# EAGLE design ReflowController (EAGLE 7.5.0)
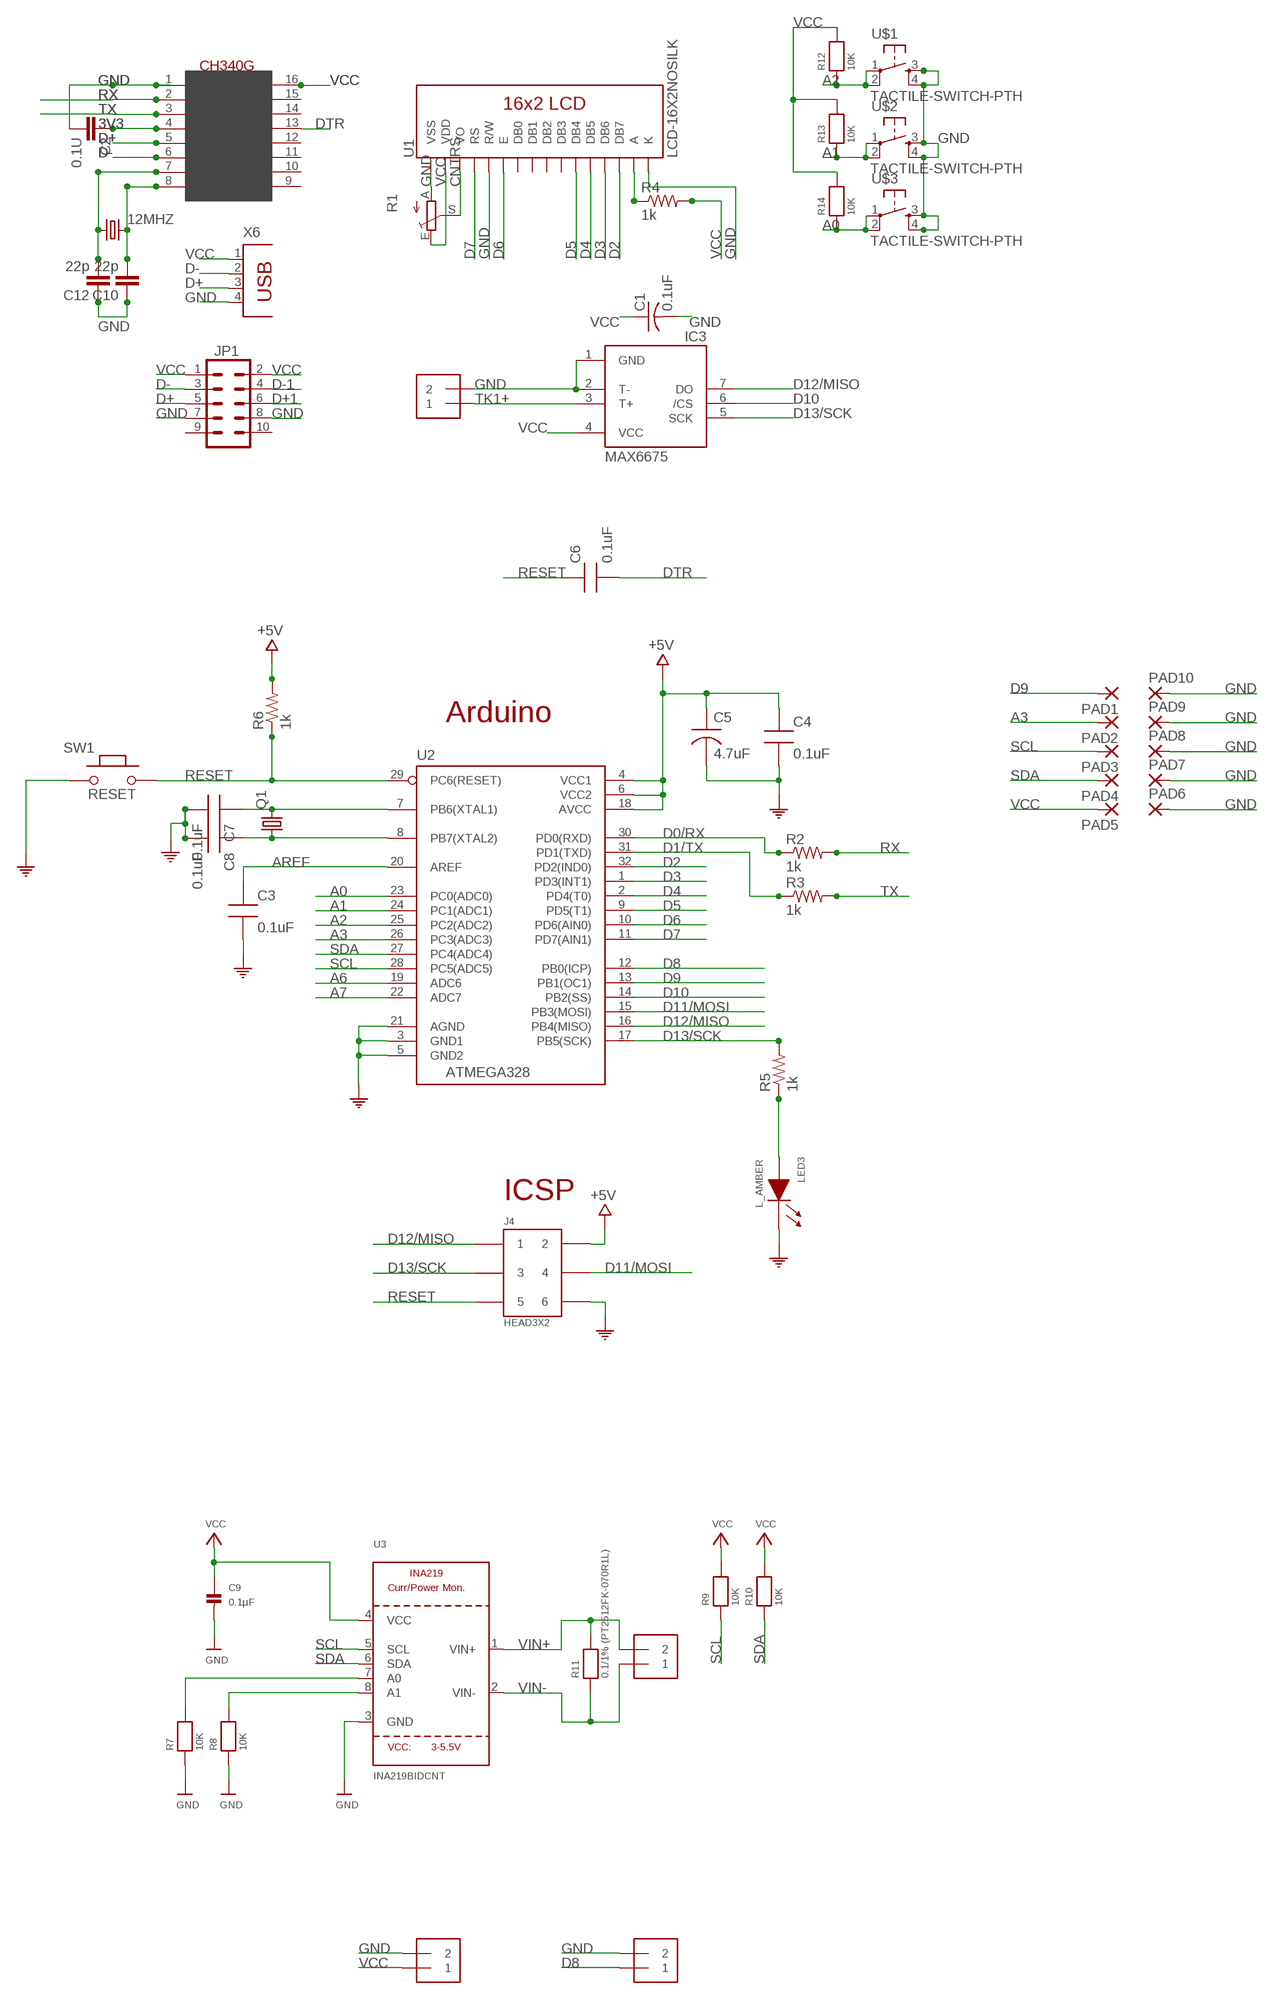
[diagram p0: schematic, sheet 1]

## Parts
12MHZ  CRYSTALHC49UP  [HC49UP]
C1  0.1uF  C-USC0805K  [C0805K]
C2  0.1U  C-EUC1206  [C1206]
C3  0.1uF  CAP0805-NP  [CAP0805-NP]
C4  0.1uF  CAP0805-NP  [CAP0805-NP]
C5  4.7uF  CAP-TANA-P  [TAN-A]
C6  0.1uF  CAP0805-NP  [CAP0805-NP]
C7  0.1uF  CAP0805-NP  [CAP0805-NP]
C8  0.1uF  CAP0805-NP  [CAP0805-NP]
C9  0.1µF  CAP_CERAMIC0805  [0805]
C10  22p  C-EUC1206  [C1206]
C12  22p  C-EUC1206  [C1206]
IC3  MAX6675  [SO08]
J1  TERMBLOCK_1X2-3.5MM  [1X2-3.5MM]
J2  1X2-3.5MM  [1X2-3.5MM]
J3  TERMBLOCK_1X2-3.5MM  [1X2-3.5MM]
J4  HEAD3X2  [HEAD3X2]
J5  TERMBLOCK_1X2-3.5MM  [1X2-3.5MM]
JP1  M05X2SHD_LOCK  [2X5-SHROUDED_LOCK]
LED3  L_AMBER  LED0805  [LED0805]
PAD1  SMD2  [SMD1,27-2,54]
PAD2  SMD2  [SMD1,27-2,54]
PAD3  SMD2  [SMD1,27-2,54]
PAD4  SMD2  [SMD1,27-2,54]
PAD5  SMD2  [SMD1,27-2,54]
PAD6  SMD2  [SMD1,27-2,54]
PAD7  SMD2  [SMD1,27-2,54]
PAD8  SMD2  [SMD1,27-2,54]
PAD9  SMD2  [SMD1,27-2,54]
PAD10  SMD2  [SMD1,27-2,54]
Q1  CRYSTALHC49UP  [HC49UP]
R1  TRIM_EU-CA9V  [CA9V]
R2  1k  RESISTOR1206  [1206]
R3  1k  RESISTOR1206  [1206]
R4  1k  RESISTOR1206  [1206]
R5  1k  RESISTOR1206  [1206]
R6  1k  RESISTOR1206  [1206]
R7  10K  RESISTOR0805  [0805]
R8  10K  RESISTOR0805  [0805]
R9  10K  RESISTOR0805  [0805]
R10  10K  RESISTOR0805  [0805]
R11  0.1/1% (PT2512FK-070R1L)  RESISTOR2512  [2512]
R12  10K  RESISTOR0805  [0805]
R13  10K  RESISTOR0805  [0805]
R14  10K  RESISTOR0805  [0805]
SW1  RESET  PB157  [157SW]
U1  LCD-16X2NOSILK  [LCD-16X2_NOSILK]
U2  ATMEGA328  ATMEGA168-20AU  [QFP032]
U3  INA219BIDCNT  INA219  [SOT23-8]
U$1  TACTILE-SWITCH-PTH  [TAC-SWITCH-PTH]
U$2  TACTILE-SWITCH-PTH  [TAC-SWITCH-PTH]
U$3  TACTILE-SWITCH-PTH  [TAC-SWITCH-PTH]
U$4  CH340G  [SOIC16]
X6  PN61729  [PN61729]

## Nets
3V3: C2.1 U$4.4(V3)
A0: R14.1 U2.23(PC0(ADC0)) U$3.1 U$3.2
A1: R13.1 U2.24(PC1(ADC1)) U$2.1 U$2.2
A2: R12.1 U2.25(PC2(ADC2)) U$1.1 U$1.2
A3: PAD2.1(P) U2.26(PC3(ADC3))
A6: U2.19(ADC6)
A7: U2.22(ADC7)
AREF: C3.1 U2.20(AREF)
CNTRS: R1.S U1.3(VO)
D0/RX: R2.1 U2.30(PD0(RXD))
D1/TX: R3.1 U2.31(PD1(TXD))
D2: U1.14(DB7) U2.32(PD2(IND0))
D3: U1.13(DB6) U2.1(PD3(INT1))
D4: U1.12(DB5) U2.2(PD4(T0))
D5: U1.11(DB4) U2.9(PD5(T1))
D6: U1.6(E) U2.10(PD6(AIN0))
D7: U1.4(RS) U2.11(PD7(AIN1))
D8: J3.1 U2.12(PB0(ICP))
D9: PAD1.1(P) U2.13(PB1(OC1))
D10: IC3.6(/CS) U2.14(PB2(SS))
D11/MOSI: J4.4 U2.15(PB3(MOSI))
D12/MISO: IC3.7(DO) J4.1 U2.16(PB4(MISO))
D13/SCK: IC3.5(SCK) J4.3 R5.2 U2.17(PB5(SCK))
D+: JP1.5 U$4.5(D+) X6.3
D+1: JP1.6
D-: JP1.3 U$4.6(D-) X6.2
D-1: JP1.4
DTR: C6.2 U$4.13(DTR)
GND: C1.2 C2.2 C3.2 C4.2 C5.2 C7.2 C8.2 C9.2 C10.1 C12.1 IC3.1(GND) IC3.2(T-) J2.2 J3.2 J4.6 J5.2 JP1.7 JP1.8 LED3.1(CA) PAD6.1(P) PAD7.1(P) PAD8.1(P) PAD9.1(P) PAD10.1(P) R1.A R7.1 R8.1 SW1.1 U1.1(VSS) U1.5(R/W) U1.16(K) U2.3(GND1) U2.5(GND2) U2.21(AGND) U3.3(GND) U$1.3 U$1.4 U$2.3 U$2.4 U$3.3 U$3.4 U$4.1(GND) X6.4 ; supply symbol labelled COM
N$1: C8.1 Q1.1 U2.8(PB7(XTAL2))
N$2: C7.1 Q1.2 U2.7(PB6(XTAL1))
N$3: R8.2 U3.8(A1)
N$4: R7.2 U3.7(A0)
N$7: LED3.2(AN) R5.1
N$11: R4.1 U1.15(A)
N$12: 12MHZ.1 C12.2 U$4.7(XI)
N$13: 12MHZ.2 C10.2 U$4.8(XO)
RESET: C6.1 J4.5 R6.1 SW1.2 U2.29(PC6(RESET))
RX: R2.2 U$4.2(TX)
SCL: PAD3.1(P) R9.1 U2.28(PC5(ADC5)) U3.5(SCL)
SDA: PAD4.1(P) R10.1 U2.27(PC4(ADC4)) U3.6(SDA)
TK1+: IC3.3(T+) J2.1
TX: R3.2 U$4.3(RX)
VCC: C1.1 C4.1 C5.1 C9.1 IC3.4(VCC) J4.2 J5.1 JP1.1 JP1.2 PAD5.1(P) R1.E R4.2 R6.2 R9.2 R10.2 R12.2 R13.2 R14.2 U1.2(VDD) U2.4(VCC1) U2.6(VCC2) U2.18(AVCC) U3.4(VCC) U$4.16(VCC) X6.1 ; supply symbol labelled +5V
VIN+: J1.2 R11.2 U3.1(VIN+)
VIN-: J1.1 R11.1 U3.2(VIN-)
Unconnected: JP1.9 JP1.10 U1.7(DB0) U1.8(DB1) U1.9(DB2) U1.10(DB3) U$4.9(CTS) U$4.10(DSR) U$4.11(RI) U$4.12(DCD) U$4.14(RTS) U$4.15(RS232)

## Notes on the sheet
- Arduino
- ICSP

## Library data of the parts
12MHZ = crystal:CRYSTAL: CRYSTAL; OC_FARNELL: unknown; OC_NEWARK: unknown
C1 = adafruit:C-US: CAPACITOR, American symbol
C2 C10 C12 = rcl:C-EU: CAPACITOR, European symbol
C3 C4 C6-C8 = MySMD:CAP0805-NP
C5 = MySMD:CAP-TANA-P
C9 = microbuilder:CAP_CERAMIC: Ceramic Capacitors 0402 - 0402 Surface Mount Capacitors 16pF 50V 5% [Digikey: 445-4899-2-ND] 18pF 50V 5% [Digikey: 490-1281-2-ND] 22pF 50V 5% [Digikey: 490-1283-2-ND] 68pF 50V 5% [Digikey: 490-1289-2-ND] 0.1uF 10V 10% [Digikey: 490-1318-2-ND] 1.0uF 6.3V 10% [Digikey: 490-1320-2-ND] 0603 - 0603 Surface Mount Capacitors 16 pF 50V 5% [Digikey: 445-5051-2-ND] 22 pF 50V [Digikey: PCC220ACVTR-ND] 33 pF 50V 5% [Digikey: 490-1415-1-ND] 56pF 50V 5% [Digikey: 490-1421-1-ND] 220pF 50V 5% [Digikey: 445-1285-1-ND] 680 pF 50V 2200 pF 50V 5% C0G [Digikey: 445-1297-1-ND] 5600 pF 100V 5% X7R [Digikey: 478-3711-1-ND] 0.1 µF 25V 10% [Digikey: PCC2277TR-ND] 0.22 µF 16V 10% X7R [Digikey: 445-1318-1-ND] 1.0 µF 25V 10% [Digikey: 445-5146-2-ND] 0603 - RF Specific 3pF 250V +/-0.1pF RF [Digikey: 712-1347-1-ND] 18 pF 250V 5% [Digikey: 478-3505-1-ND or 712-1322-1-ND] 56 pF 250V 5% C0G RF [Digikey: 490-4867-1-ND] 68 pF 250V RF [Digikey: 490-4868-1-ND] 0805 - 0805 Surface Mount Capacitors 220 pF 250V 2% RF Ceramic Capacitor [Digikey: 712-1398-1-ND] 1000 pF 50V 2% NP0 Ceramic Capacitor [Digikey: 478-3760-1-ND] 0.1 µF 25V 10% Ceramic Capacitor [Digikey: PCC1828TR-ND] 1.0 µF 16V 10% Ceramic Capacitor[Digikey: 490-1691-2-ND] 10.0 µF 10V 10% Ceramic Capacitor[Digikey: 709-1228-1-ND] 10.0 uF 16V 10% Ceramic Capacitor [Digikey: 478-5165-2-ND] 47 uF 6.3V 20% Ceramic Capacitor [Digikey: 587-1779-1-ND or 399-5506-1-ND] 1206 - 1206 Surface Mount Capacitors 47uF 10V 20% Ceramic Capacitor [Digikey: 490-5528-1-ND or 399-5508-1-ND or 445-6010-1-ND] 100uF 6.3V -20%, +80% Y5V Ceramic Capacitor (Digikey: 490-4512-1-ND, Mouser: 81-GRM31CF50J107ZE1L)
IC3 = adafruit:MAX6675
J1 J3 J5 = microbuilder:TERMBLOCK_1X2: 3.5mm Terminal block http://www.ladyada.net/library/pcb/eaglelibrary.html
J2 = adafruit:1X2: 3.5mm Terminal block http://www.ladyada.net/library/pcb/eaglelibrary.html
J4 = MyCON2:HEAD3X2
JP1 = SparkFun-Connectors:M05X2: Header 5x2 Standard 10-pin dual row 0.1" header. Commonly used with AVR-ISP. Use with Spark Fun Electronics SKU: PRT-00778
LED3 = MySMD:LED0805
PAD1-PAD10 = wirepad:SMD2: SMD PAD
Q1 = adafruit:CRYSTAL: CRYSTAL; OC_FARNELL: unknown; OC_NEWARK: unknown
R1 = pot:TRIM_EU-: POTENTIOMETER
R2-R6 = SparkFun-Passives:RESISTOR: Resistor Basic schematic elements and footprints for 0603, 1206, and PTH resistors.
R7-R14 = microbuilder:RESISTOR: Resistors 0402 - 0402 Surface Mount Package 22 Ohm 1% 1/16W [Digikey: 311-22.0LRTR-ND] 33 Ohm 5% 1/16W 1.0K 5% 1/16W 1.5K 5% 1/16W 2.0K 1% 1/16W 10.0K 1% 1/16W [Digikey: 311-10.0KLRTR-ND] 10.0K 5% 1/16W [Digikey: RMCF0402JT10K0TR-ND] 12.1K 1% 1/16W [Digikey: 311-22.0LRTR-ND] 100.0K 5% 1/16W 0603 - 0603 Surface Mount Package 0 Ohm 1/10 Watt 1% Resistor 15 Ohm 1/10 Watt 1% Resistor 33 Ohm 1/10 Watt 1% Resistor 49.9 Ohm 1/10 Watt 1% Resistor 100 Ohm 1/10 Watt 1% Resistor 150 Ohm 1/10 Watt 1% Resistor 240 Ohm 1/10 Watt 1% Resistor 390 Ohm 1/10 Watt 1% Resistor 560 Ohm 1/10 Watt 1% Resistor 680 Ohm 1/10 Watt 1% Resistor 750 Ohm 1/10 Watt 1% Resistor 1.0K Ohm 1/10 Watt 1% Resistor 1.5K Ohm 1/10 Watt 1% Resistor 2.0K Ohm 1/10 Watt 1% Resistor 2.2K Ohm 1/10 Watt 1% Resistor 3.3K Ohm 1/10 Watt 1% Resistor 4.7K Ohm 1/10 Watt 1% Resistor 10.0K Ohm 1/10 Watt 1% Resistor 12.0K Ohm 1/10 Watt 1% Resistor 12.1K Ohm 1/10 Watt 1% Resistor 20.0K Ohm 1/10 Watt 1% Resistor 33.0K Ohm 1/10 Watt 1% Resistor 100.0K Ohm 1/10 Watt 1% Resistor 0805 - 0805 Surface Mount Package 0 Ohm 1/8 Watt 1% Resistor 33 Ohm 1/8 Watt 1% Resistor 100 Ohm 1/8 Watt 1% Resistor 150 Ohm 1/8 Watt 1% Resistor 200 Ohm 1/8 Watt 1% Resistor 240 Ohm 1/8 Watt 1% Resistor 330 Ohm 1/8 Watt 1% Resistor 390 Ohm 1/8 Watt 1% Resistor 470 Ohm 1/8 Watt 1% Resistor 1.0K Ohm 1/8 Watt 1% Resistor 1.5K Ohm 1/8 Watt 1% Resistor 2.0K Ohm 1/8 Watt 1% Resistor 4.7K Ohm 1/8 Watt 1% Resistor 5.1K Ohm 1/8 Watt 1% Resistor 5.6K Ohm 1/8 Watt 1% Resistor 10.0K Ohm 1/8 Watt 1% Resistor 22.0K Ohm 1/8 Watt 1% Resistor 33.0K Ohm 1/8 Watt 1% Resistor 100K Ohm 1/8 Watt 1% Resistor 1206 - 1206 Surface Mount Package 2012 - 2010 Surface Mount Package 0.11 Ohm 1/2 Watt 1% Resistor - Digikey: RHM.11UCT-ND
SW1 = MySMD:PB157
U1 = SparkFun-Displays:LCD-16X2: Standard text-only 16x2 parallel input LCD
U2 = MySMD:ATMEGA168-20AU
U3 = microbuilder:INA219: INA219 - I2C Current/Power Monitor Voltage Range: 0-26V Accuracy: 0.5% Temperature: -40°C - 125°C
U$1-U$3 = GeekAmmo:TACTILE-SWITCH: Tactile Switch 4 Pins, SPST NO
U$4 = usb-serial:CH340G
X6 = con-berg:PN61729: BERG USB connector; OC_FARNELL: unknown; OC_NEWARK: unknown

## Board
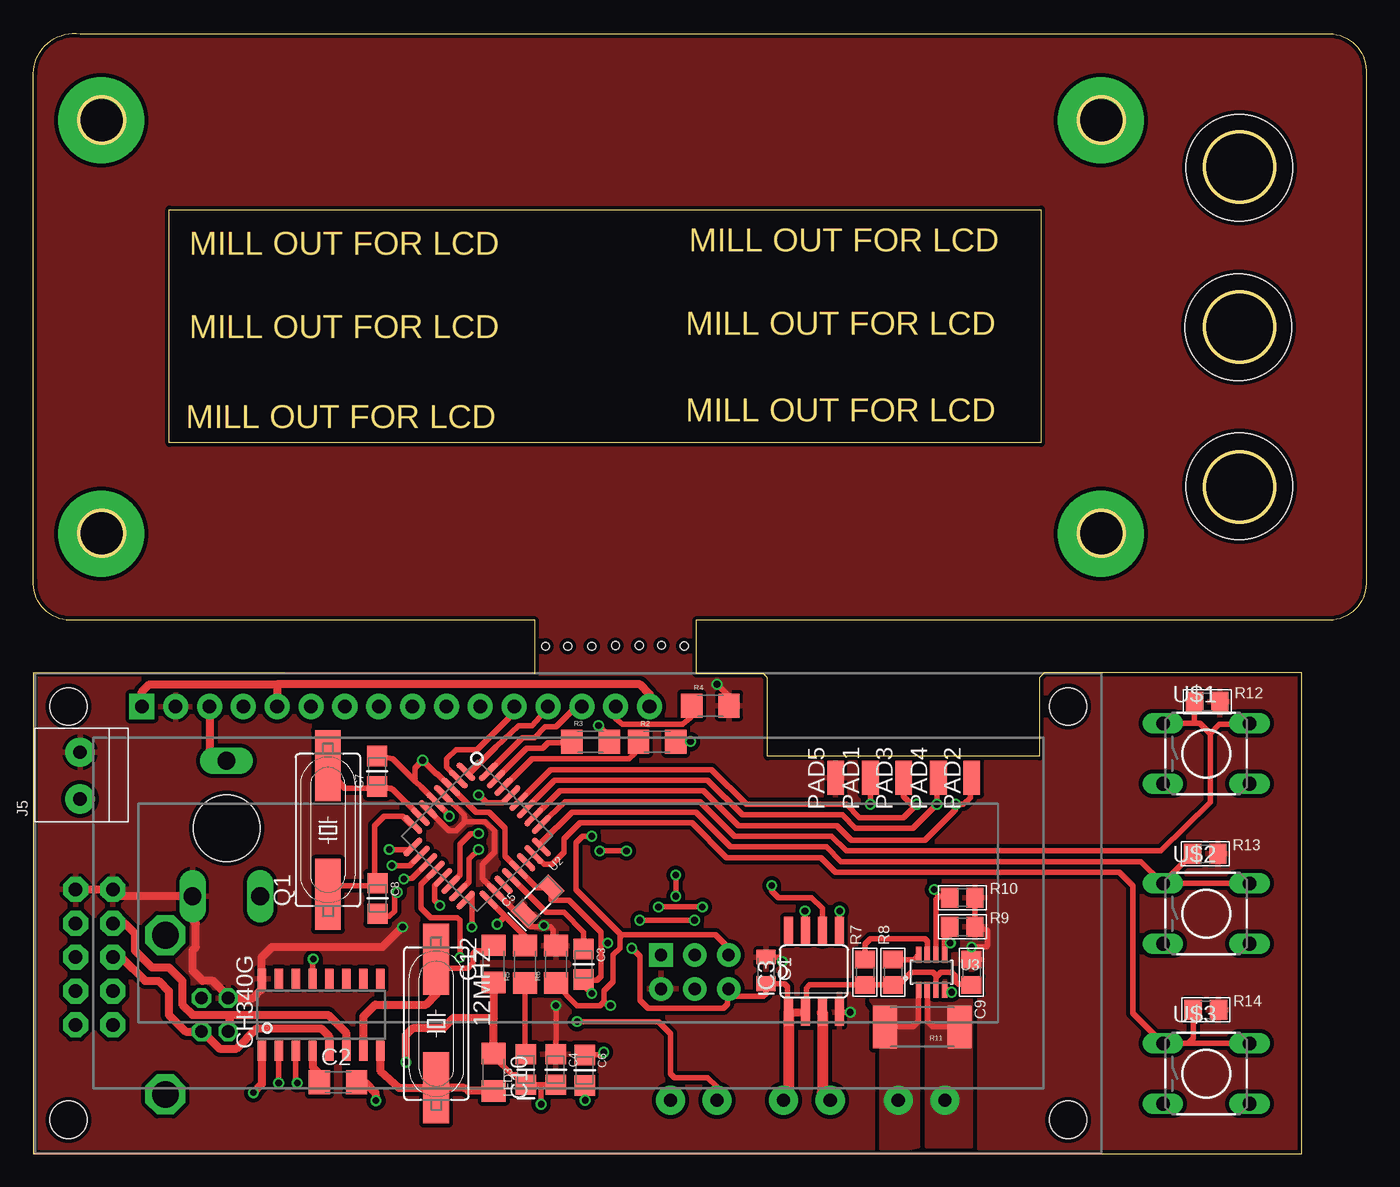
[diagram p1: board, top side]
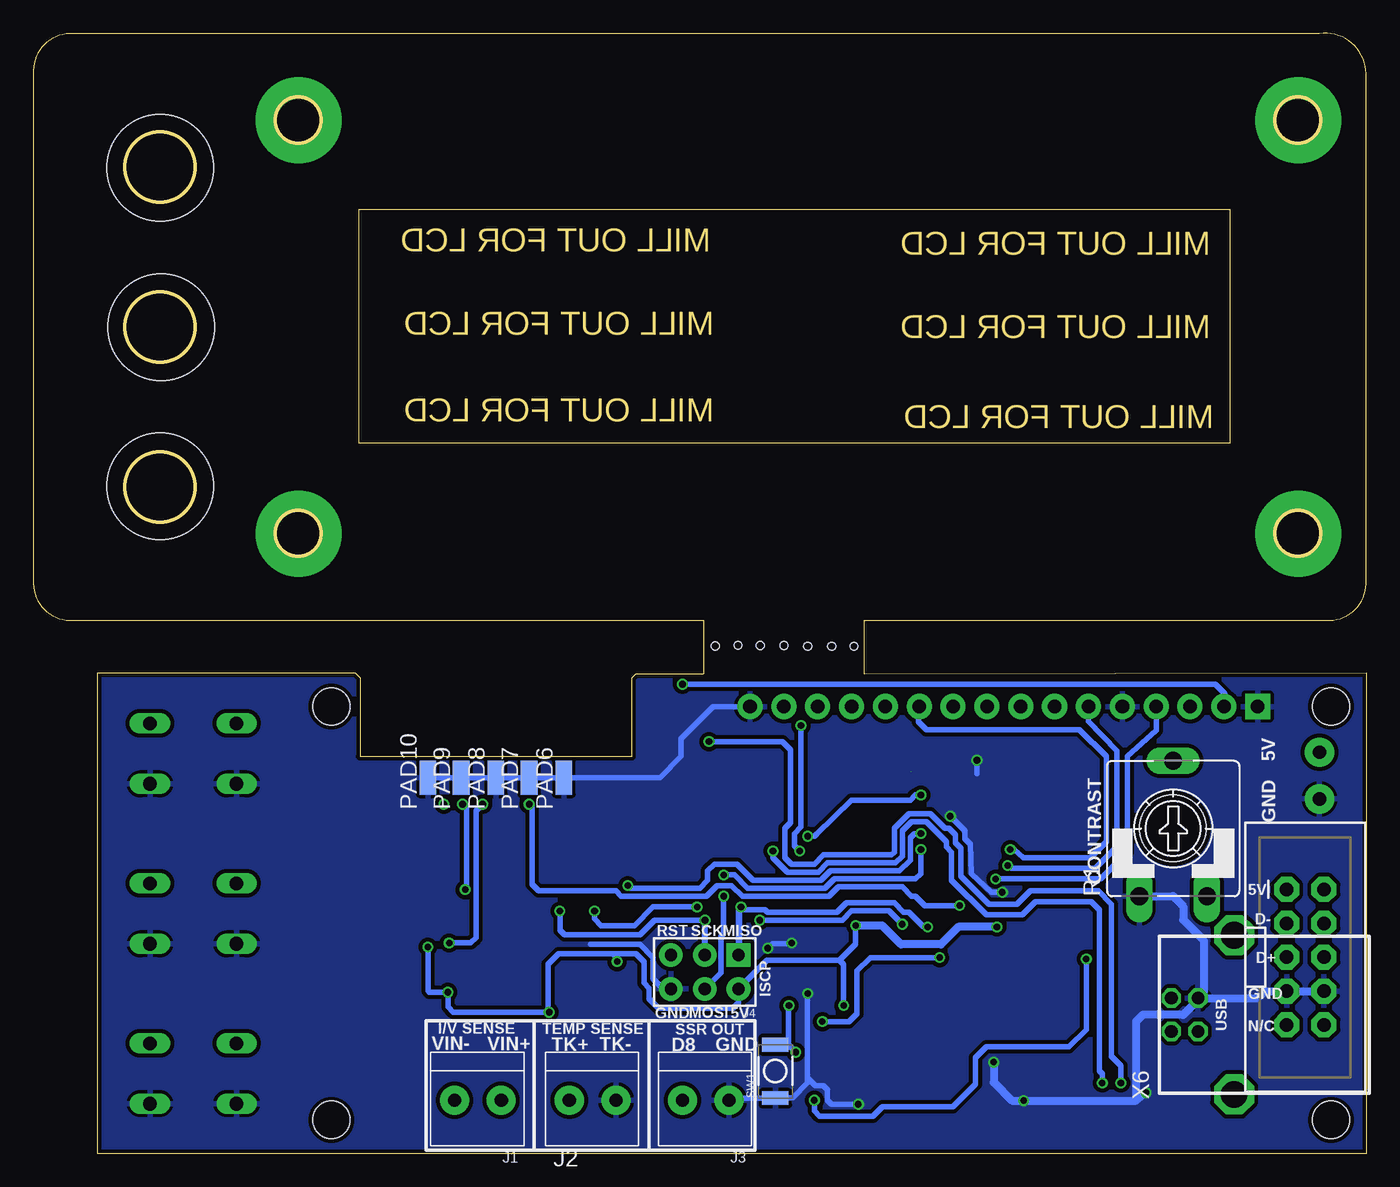
[diagram p2: board, bottom side, seen from below]

Size 100.01 x 84.03 mm. Coordinates in mm from the lower left corner, seen from the top.
Outline: 0,0 95.18,0 95.18,36.06 75.86,36.06 75.5,35.7 75.5,29.8 55.1,29.8 55.1,35.7 54.8,36 49.73,36 49.73,40 97,40 arc97 100,43 100,81 arc97 97,84 3.5,84 arc97 0,81 0,43 arc97 3,40 37.63,40 37.63,36 0,36.06 0,0
Outline: 10.2,70.8 75.6,70.8 75.6,53.3 10.2,53.3 10.2,70.8
Outline: circle at 90.5,74 radius 2.62
Outline: circle at 90.5,62 radius 2.62
Outline: circle at 90.5,50 radius 2.62
Outline: circle at 5.13,77.53 radius 1.71
Outline: circle at 80.15,77.53 radius 1.71
Outline: circle at 5.13,46.52 radius 1.71
Outline: circle at 80.13,46.52 radius 1.71
Copper layers (1*16): Top 0.035mm / dielectric 1.5mm / Bottom 0.035mm
Design rules "dirt_cheap_dirty_boards.v1": minimum track width 5mil, minimum drill 12mil, track to track 5mil, track to pad 5mil, pad to pad 5mil, via to via 5mil, smd to smd 0mil, copper to edge 10mil, drill to drill 10mil, minimum pad ring 10mil, minimum via ring 6mil, stop-mask expansion 2mil, vias tented up to drill 25mil, thermal gap 10mil
Holes 5 mm at 14.5,24.4
Holes 8 mm at 90.5,50.05 90.43,61.98 90.5,73.95
Holes 0.6 mm at 38.43,38.05 40.1,38.05 41.9,38.05 43.68,38.1 45.45,38.1 47.13,38.12 48.83,38.08

### Footprints (pad centres in the part's own frame; a part is rotated, then mirrored left to right if it is on the bottom)
HC49UP = smd 5.334 x 1.93: 1 -4.826,0; 2 4.826,0
C0805K = smd 1.1 x 1.4: 1 -1,0; 2 1,0
C1206 = smd 1.6 x 1.8: 1 -1.4,0; 2 1.4,0
CAP0805-NP = smd 1.524 x 1.524: 1 0,0; 2 2.286,0
TAN-A = smd 1.118 x 1.778: 1 0,0; 2 2.794,0
0805 = smd 1.3 x 1.5: 1 -0.95,0; 2 0.95,0
SO08 = smd 0.66 x 2.032: 1 -1.905,-3.073; 2 -0.635,-3.073; 3 0.635,-3.073; 4 1.905,-3.073; 5 1.905,3.073; 6 0.635,3.073; 7 -0.635,3.073; 8 -1.905,3.073
1X2-3.5MM = drill 1 pad 2.184: 1 1.8,0; 2 -1.7,0
HEAD3X2 = drill 0.914 pad 1.778 square: 1 0,0 | drill 0.914 pad 1.778: 2 0,2.54; 3 2.54,0; 4 2.54,2.54; 5 5.08,0; 6 5.08,2.54
2X5-SHROUDED_LOCK = drill 1.016 pad 1.88 octagon: 1 -1.397,5.08; 2 1.397,5.08; 3 -1.397,2.54; 4 1.397,2.54; 5 -1.397,0; 6 1.397,0; 7 -1.397,-2.54; 8 1.397,-2.54; 9 -1.397,-5.08; 10 1.397,-5.08
LED0805 = smd 1.524 x 1.524: 1 0,0; 2 2.286,0
SMD1,27-2,54 = smd 1.27 x 2.54: 1 0,0
CA9V = drill 1.321 long: A -2.54,-5.08; E 2.54,-5.08; S 0,5.08
1206 = smd 1.6 x 1.8: 1 -1.4,0; 2 1.4,0
2512 = smd 1.8 x 3.2: 1 -2.8,0; 2 2.8,0
157SW = smd 1.016 x 1.981: 1 0,0; 2 4,0
LCD-16X2_NOSILK = drill 1.016 pad 1.88 square: 1 -32,15.5 | drill 1.016 pad 1.88: 2 -29.46,15.5; 3 -26.92,15.5; 4 -24.38,15.5; 5 -21.84,15.5; 6 -19.3,15.5; 7 -16.76,15.5; 8 -14.22,15.5; 9 -11.68,15.5; 10 -9.14,15.5; 11 -6.6,15.5; 12 -4.06,15.5; 13 -1.52,15.5; 14 1.02,15.5; 15 3.56,15.5; 16 6.1,15.5 | hole 2.8: -37.5,15.5; -37.5,-15.5; 37.5,15.5; 37.5,-15.5
QFP032 = smd 0.432 x 1.778: 1 0,0; 2 0.8,0; 3 1.599,0; 4 2.399,0; 5 3.199,0; 6 3.998,0; 7 4.798,0; 8 5.598,0; 17 5.588,8.001; 18 4.798,7.997; 19 3.998,7.997; 20 3.199,7.997; 21 2.399,7.997; 22 1.599,7.997; 23 0.799,7.997; 24 0,7.997 | smd 1.778 x 0.432: 9 6.807,1.194; 10 6.807,2.007; 11 6.807,2.794; 12 6.807,3.607; 13 6.807,4.394; 14 6.807,5.182; 15 6.807,5.994; 16 6.816,6.803; 25 -1.194,6.807; 26 -1.194,5.994; 27 -1.194,5.182; 28 -1.194,4.394; 29 -1.194,3.607; 30 -1.194,2.794; 31 -1.194,2.007; 32 -1.194,1.194
SOT23-8 = smd 0.4 x 1.2: 1 -0.975,-1.3; 2 -0.325,-1.3; 3 0.325,-1.3; 4 0.975,-1.3; 5 0.975,1.3; 6 0.325,1.3; 7 -0.325,1.3; 8 -0.975,1.3
TAC-SWITCH-PTH = drill 1.016 pad 1.524 long: 1 -3.251,2.261; 2 3.251,2.261; 3 -3.251,-2.261; 4 3.251,-2.261
SOIC16 = smd 0.635 x 1.524: 1 -4.445,-2.695; 2 -3.175,-2.695; 3 -1.905,-2.695; 4 -0.635,-2.695; 5 0.635,-2.695; 6 1.905,-2.695; 7 3.175,-2.695; 8 4.445,-2.695; 9 4.445,2.695; 10 3.175,2.695; 11 1.905,2.695; 12 0.635,2.695; 13 -0.635,2.695; 14 -1.905,2.695; 15 -3.175,2.695; 16 -4.445,2.695
PN61729 = drill 0.95 octagon: 1 1.25,4.71; 2 -1.25,4.71; 3 -1.25,2.71; 4 1.25,2.71 | drill 2 octagon: P$1 -5.969,0; P$2 5.969,0

### Placement (x,y rotation side)
12MHZ  30.23,9.76 270 top
C1  54.97,13.74 270 top
C2  22.86,5.33 0 top
C3  41.29,15.34 270 top
C4  39.19,7.45 270 top
C5  36.87,17.97 45 top
C6  41.37,7.4 270 top
C7  25.8,27.54 90 top
C8  25.83,20.28 270 top
C9  70.4,13.6 270 top
C10  34.55,6.1 270 top
C12  34.55,14.22 90 top
IC3  58.57,13.67 0 top
J1  66.6,4 180 bottom
J2  57.99,4 180 bottom
J3  49.5,4 180 bottom
J4  47.09,14.89 180 bottom
J5  3.5,28.3 90 top
JP1  4.58,14.73 0 bottom
LED3  36.95,5.16 90 top
PAD1  62.8,28.2 0 top
PAD2  70.4,28.2 0 top
PAD3  65.3,28.2 0 top
PAD4  67.9,28.2 0 top
PAD5  60.2,28.2 0 top
PAD6  60.2,28.2 0 bottom
PAD7  62.8,28.2 0 bottom
PAD8  65.3,28.2 0 bottom
PAD9  67.9,28.2 0 bottom
PAD10  70.4,28.2 0 bottom
Q1  22.11,24.27 90 top
R1  14.48,24.38 0 bottom
R2  46.8,30.9 0 top
R3  41.8,30.9 0 top
R4  50.8,33.6 0 top
R5  36.9,14.2 90 top
R6  39.2,14.2 90 top
R7  62.4,13.6 90 top
R8  64.5,13.6 90 top
R9  69.7,17 0 top
R10  69.7,19.2 0 top
R11  66.7,9.5 180 top
R12  88.08,33.88 0 top
R13  87.93,22.48 0 top
R14  87.98,10.78 0 top
SW1  44.33,4.16 90 bottom
U1  40.14,18.03 0 top
U2  32.45,28.65 225 top
U3  67.4,13.6 0 top
U$1  88,30 0 top
U$2  88,18 0 top
U$3  88,6 0 top
U$4  21.59,10.41 0 top
X6  9.91,10.41 90 bottom

### Tracks (layer width: path | path; a pad name or v marks a point on that pad's centre or on a via)
3V3
  Top 0.61: U$4.4 20.96,6.48 21.59,5.84 21.59,5.46 C2.1
A0
  Top 0.406: U2.23 37.58,22.43 38.3,21.7 38.9,21.7 39.8,22.6 39.8,23.6 41,24.8 49.4,24.8 52,22.2 59.1,22.2 60.2,21.1 81.5,21.1 82.5,20.1 82.5,10.51 U$3.1 86.65,8.26 | 86.65,8.26 U$3.2 | R14.1 87.03,8.64 86.65,8.26
A1
  Top 0.406: U2.24 38.11,23.3 40.4,25.6 49.7,25.6 52.3,23 59.5,23 60.6,21.9 83.11,21.9 U$2.1 | U$2.1 U$2.2 | R13.1 U$2.1
A2
  Top 0.406: U2.25 38.11,24.71 39.9,26.4 50,26.4 52.6,23.8 59.9,23.8 61,22.7 84.6,22.7 88.33,26.35 88.3,31.5 | 88.3,31.5 89,32.2 91.2,32.2 U$1.2 | U$1.1 87.54,32.26 | 87.54,32.26 88.3,31.5 | R12.1 87.13,32.3 87.54,32.26
A3  (via drill 0.5)
  Top 0.406: U2.26 37.56,25.25 39.5,27.2 50.3,27.2 52.9,24.6 60.3,24.6 61.4,23.5 66.9,23.5 69.2,25.8 v69.2,26.2 69.8,26.2 70.3,26.7 70.3,28.1 PAD2.1
AREF
  Top 0.406: C3.1 41.29,16.62 39.8,18.1 38.48,18.1 U2.20
CNTRS
  Top 0.61: U1.3 13.22,30.22 13.97,29.46 R1.S
D0/RX
  Top 0.406: U2.30 35.32,27.52 37.4,29.6 44.7,29.6 45.1,30 R2.1
D1/TX
  Top 0.406: U2.31 34.72,28.11 37,30.4 38.2,30.4 38.6,30.8 40,30.8 R3.1
D2  (1 unrouted)
  Top 0.406: 41.14,33.53 U1.14 41.02,33.4 40.6,33.4 39.2,32 38.4,32 37.6,31.2 36.69,31.2 U2.32
D3
  Top 0.406: U1.13 38.64,33.43 37.4,32.1 36.4,32.1 34.7,30.5 32.6,28.4 U2.1
D4
  Top 0.406: U1.12 36.08,33.07 33.3,30.3 31.7,30.3 31,29.6 31,28.97 U2.2
D5  (via drill 0.5)
  Top 0.406: U2.9 28.39,22.99 28.2,22.8 v26.7,22.8
  Bottom 0.406: v26.7,22.8 26.4,22.8 25.7,22.2 20.7,22.2 19.5,23.4 19.5,29.8 21.5,31.8 33,31.8 33.6,32.4 33.6,33.47 U1.11
D6  (via drill 0.5)
  Top 0.406: v26.9,21.6 28.24,21.6 U2.10
  Bottom 0.406: U1.6 20.84,32.43 18.7,30.2 18.7,23 20.3,21.4 26.6,21.4 v26.9,21.6
D7  (via drill 0.5)
  Top 0.406: v27.8,20.6 28.4,20.65 U2.11
  Bottom 0.406: U1.4 15.76,31.75 17.9,29.8 17.9,22.6 19.9,20.6 v27.8,20.6
D8  (via drill 0.5)
  Top 0.406: U2.12 29.1,20.2 29.1,18.4 29.8,17.7 31.8,17.7 32,17.5 v32,14.7 | v40.8,9.9 46.9,9.9 47.8,9 47.8,6 48.1,5.7 50.6,5.7 51.3,5 J3.1
  Bottom 0.406: v32,14.7 37.2,14.7 38.2,13.7 38.2,10.5 38.8,9.9 v40.8,9.9
D9  (via drill 0.5)
  Top 0.406: U2.13 30.73,20.73 30.1,20.1 30.1,19 v30.5,18.6 | v62.8,26.2 PAD1.1
  Bottom 0.406: v30.5,18.6 33.1,18.6 33.8,19.3 34.1,19.3 34.8,20 39.6,20 40.3,19.3 46.8,19.3 47.6,20.1 48.7,20.1 49.5,19.3 55.9,19.3 56.3,19.7 62.1,19.7 62.6,20.2 62.6,26 v62.8,26.2
D10  (via drill 0.5)
  Top 0.406: U2.14 31.31,20.2 32,20.9 32,23.2 32.8,24 v33.4,24 | 59.2,15.84 IC3.6 59.21,18.4 58.4,19.2 55.9,19.2 55.4,19.7 v55.4,20.1
  Bottom 0.406: v33.4,24 33.9,24 34.2,23.7 34.2,22 35,21.2 40.2,21.2 40.9,20.5 46,20.5 47.2,21.7 48.9,21.7 49.4,21.2 49.4,20.5 50,19.9 55.2,19.9 v55.4,20.1
D11/MOSI  (via drill 0.5)
  Top 0.406: U2.15 31.9,19.6 32.7,20.4 32.7,22.1 v33.4,22.8 | v48.2,20.9 v48.2,19.3
  Bottom 0.406: v48.2,19.3 48.2,16.5 48.4,16.3 48.4,13.58 J4.4 | v33.4,22.8 33.4,21 33.8,20.6 39.9,20.6 40.6,19.9 46.4,19.9 47.4,20.9 v48.2,20.9
D12/MISO  (via drill 0.5)
  Top 0.406: v46.9,18.5 v50.2,18.5 | v32.9,17 32.9,19.48 | 32.9,19.5 32.9,19.48 | 32.9,19.48 U2.16 | v57.9,18.2 57.9,16.77 IC3.7
  Bottom 0.406: 47,18.4 v46.9,18.5 46.7,18.3 45.1,18.3 44.9,18.1 39.7,18.1 39,18.8 35.4,18.8 34.7,18.1 34.3,18.1 33.2,17 v32.9,17 | 47,18.4 47,14.98 J4.1 47.09,18.31 47,18.4 | v50.2,18.5 53.5,18.5 54.9,17.1 57.4,17.1 57.9,17.6 v57.9,18.2
D13/SCK  (via drill 0.5)
  Top 0.406: U2.17 36.9,16.3 R5.2 36.9,16.3 35.4,17.8 v34.8,17.2 | v45.5,17.5 v49.6,17.5 | v60.5,18.2 60.5,16.77 IC3.5
  Bottom 0.406: v34.8,17.2 35.8,18.2 38.6,18.2 39.3,17.5 v45.5,17.5 | v49.6,17.5 49.6,14.92 J4.3 49.63,17.47 v49.6,17.5 | v49.6,17.5 53.4,17.5 54.5,16.4 60.14,16.4 IC3.5 60.48,18.17 v60.5,18.2
D+
  Top 0.61: U$4.5 22.23,8.76 21.59,9.4 16.77,9.4 15.24,7.87 13.97,7.87 13.13,8.72 X6.3 12.6,9.14 11.43,9.14 10.16,10.41 10.16,12.19 9.4,12.95 8.39,12.95 6.61,14.73 JP1.5
D-
  Top 0.61: 14.74,10.41 14.76,9.16 X6.2 14.74,9.3 14.74,10.41 | 14.74,10.41 22.1,10.41 23.5,9.02 U$4.6 | JP1.3 6.86,17.27 7.62,16.51 7.62,15.24 8.89,13.97 10.16,13.97 11.18,12.95 11.18,11.18 11.94,10.41 14.74,10.41
DTR  (via drill 0.5)
  Top 0.406: U$4.13 20.96,14.55 v21,14.6 | v41.4,4 41.4,5.08 C6.2
  Bottom 0.406: v21,14.6 21,9.3 22.3,8 28.5,8 29.3,7.2 29.3,5.2 31,3.5 36.3,3.5 37,2.8 41,2.8 41.4,3.2 v41.4,4
GND  (via drill 0.5, 0.5 pad 0.25)
  Top 0.406: C7.2 26.95,29.63 28.64,27.94 | 28.64,27.94 29.08,27.5 29.1,27.5 30.19,26.41 U2.5 31.2,25.37 v31.2,25.3 | v27.3,19.6 27.1,19.4 27.1,18.2 26.7,17.8 25.73,17.8 C8.2 | 42.6,15.8 42.6,16.6 40.2,19 38.9,19 38.85,19.06 C5.2 37.77,19.94 U2.21 35.4,22.3 35.4,24.4 34.2,25.6 33.24,25.6 U2.3 31.32,27.48 30.3,28.5 30.2,28.5 v29.2,29.5 28.64,28.94 28.64,27.94 | 42.6,15.8 42.6,13.3 42.3,13 41.34,13 | 41.34,13 C3.2 | 38.1,5.16 LED3.1 36.21,5.9 35.9,5.9 34.55,7.26 C10.1 | 38.1,5.16 C4.2 | 41.34,13 41.34,12.56 v41.9,12 | v38.1,3.7 38.1,5.16 | v43.1,15.8 42.6,15.8 | v44.9,15.4 45.5,14.8 45.5,11.5 46.1,10.9 51.8,10.9 52.1,11.2 52.1,12.28 J4.6 52.72,11.8 54.8,11.8 54.97,11.97 C1.2 56.37,12.74 56.6,12.5 56.6,10.66 IC3.1 | C9.2 70.35,12.7 69.4,12.7 69.2,12.9 69.2,13.3 68.9,13.6 68.1,13.6 67.73,13.22 U3.3 67.73,13.38 67.5,13.6 65.9,13.6 64.95,12.65 R8.1 R7.1 58.25,12.65 58,12.4 58,10.66 IC3.2
  Top 0.61: C2.2 24.9,5.33 25.66,4.57 v25.71,3.97 | v16.51,4.57 17.15,5.21 U$4.1 | C12.1 34.55,10.16 | C10.1 34.55,10.16 | 34.55,10.16 31.5,10.16 30.74,9.4 28.45,9.4 27.94,8.89 v27.94,6.86 | U1.1 8.14,34.63 8.7,35.2 18.3,35.2 | 18.3,35.2 18.3,33.54 U1.5 | U1.16 46.24,34.47 45.5,35.2 18.3,35.2 | IC3.1 IC3.2
  Top 0.813: IC3.1 56.67,4.38 J2.2
  Bottom 0.406: v41.9,12 41.9,5.7 | 41.9,5.7 41.3,5.1 40.7,5.1 40.4,4.8 40.4,4 40.1,3.7 v38.1,3.7 | v27.3,19.6 28.1,19.6 29.6,21 29.7,23.2 30.1,23.6 30.1,24.2 v31.2,25.3 | 41.9,5.7 41.9,5.3 43,4.2 44.3,4.2 | v43.1,15.8 43.26,15.75 44.56,15.75 v44.9,15.4 | J4.6 52.2,12.32 52.2,12.2 52.6,12.2 53.5,13.1 53.5,14.7 54.5,15.7 58.2,15.7 | SW1.1 47.64,4.16 J3.2 | PAD10.1 PAD9.1 PAD8.1 PAD7.1 PAD6.1 53,28.2 51.4,29.8 51.4,31.1 49,33.5 46.27,33.5 U1.16 | v29.2,29.5 29.2,28.5
  Bottom 0.61: 17.28,3.97 v25.71,3.97 26.58,3.97 27.94,5.33 v27.94,6.86 | 17.28,3.97 v16.51,4.57 | X6.4 12.62,11.51 13.72,10.41 16.77,10.41 17.28,9.91 17.28,3.97 | X6.4 8.15,11.66 7.62,12.19 JP1.7 JP1.8 | R1.A 14.48,19.3 13.72,18.54 13.72,17.53 12.2,16 12.2,12.09 X6.4
  pour Bottom (isolate 0.305): -0.1,84 100.5,84.1 100.5,-0.2 -0.2,-0.3 -0.3,-0.4 -0.3,36.5
N$1
  Top 0.406: U2.8 28.31,24.69 27.7,25.3 26.3,25.3 25.6,24.6 25.6,20.4 25.3,20.1 | 25.8,20.11 C8.1 25.55,20.1 25.3,20.1 | Q1.1 22.71,19.81 23,20.1 25.3,20.1
N$2
  Top 0.406: U2.7 26.98,27.34 C7.1 26.84,27.4 23.3,27.4 Q1.2
N$3
  Top 0.406: R8.2 66.08,14.55 U3.8
N$4
  Top 0.406: U3.7 67.08,15.93 66.9,16.1 62.8,16.1 62.4,15.7 R7.2
N$5  (via drill 3.2 pad 6.45)
  other vias: 80.1,77.5
N$6  (via drill 3.2 pad 6.45)
  other vias: 80.1,46.5
N$7
  Top 0.406: R5.1 36.9,7.5 LED3.2
N$8  (via drill 3.2 pad 6.45)
  other vias: 5.1,46.5
N$9  (via drill 3.2 pad 6.45)
  other vias: 5.1,77.5
N$11
  Top 0.406: U1.15 43.7,32.61 44.2,32.2 48.7,32.2 49.3,32.7 R4.1
N$12
  Top 0.406: 34.15,15.22 33.23,15.22 33,15 33,14.3 32.6,13.9 30.33,13.9 30.23,14
  Top 0.61: U$4.7 24.77,10.29 25.66,11.18 29.47,11.18 30.23,11.94 30.23,14 12MHZ.1 | C12.2 34.15,15.22
N$13
  Top 0.61: U$4.8 26.04,6.22 27.43,4.93 12MHZ.2 32.31,4.93 32.65,4.7 C10.2
RESET  (via drill 0.5)
  Top 0.406: U2.29 35.2,26.3 34,26.3 v33.4,26.9 | v41.9,23.8 41.2,23.8 40.7,23.3 40.7,19.8 44,16.5 44,16.2 | 44,16.2 44,15.4 43.5,14.9 43.5,12.9 42.8,12.2 42.8,11.4 | 44,16.2 44.2,16.4 51.2,16.4 52.1,15.5 52.1,14.96 J4.5 | R6.1 39.2,12.7 40.8,11.1 42.5,11.1 42.8,11.4 | v43.3,11.1 43.1,11.1 42.8,11.4 | C6.1 42.61,7.4 v42.8,7.6
  Bottom 0.406: v33.4,26.9 33.8,26.9 34.2,26.5 38.6,26.5 41.2,24 41.4,23.8 v41.9,23.8 | SW1.2 43.34,8.16 | 43.34,8.16 43.34,11.06 v43.3,11.1 | v42.8,7.6 42.8,7.63 43.34,8.16
RX  (via drill 0.5)
  Top 0.406: U$4.2 18.42,5.62 v18.4,5.3 | R2.2 v49.3,30.9
  Bottom 0.406: v18.4,5.3 18.4,6.6 19.1,7.3 19.1,18.7 20.1,19.7 25.2,19.7 26.2,18.7 28.3,18.7 30.4,20.8 30.4,22.9 30.8,23.3 30.8,23.9 31.3,24.4 31.6,24.4 32.7,25.5 34.3,25.5 35.4,24.4 35.4,22.6 35.6,22.4 40.7,22.4 41.4,21.7 43.1,21.7 43.6,22.2 43.6,24.4 43.2,24.8 43.2,30.3 43.8,30.9 v49.3,30.9
SCL  (via drill 0.5)
  Top 0.406: U2.28 36.41,26.4 38.8,28.8 50.9,28.8 53.5,26.2 61,26.2 62,25.2 65.3,25.2 v66.3,26.2 65.9,26.2 65.3,26.8 PAD3.1 | U3.5 68.38,16.62 R9.1 68.75,15.85 v68.8,15.8
  Bottom 0.406: v68.8,15.8 67.2,15.8 66.8,16.2 66.8,25.7 v66.3,26.2
SDA  (via drill 0.5)
  Top 0.406: U2.27 36.96,25.86 39.1,28 50.6,28 53.2,25.4 60.7,25.4 61.7,24.4 66,24.4 v67.8,26.2 67.8,28.1 PAD4.1 | U3.6 67.73,19.02 68,19.3 | 68,19.3 68.65,19.3 R10.1 | v67.6,19.8 67.6,19.7 68,19.3
  Bottom 0.406: v67.8,26.2 67.5,25.9 67.5,19.9 v67.6,19.8
TK1+
  Top 0.813: IC3.3 59.21,4.59 J2.1
TX  (via drill 0.5)
  Top 0.406: U$4.3 19.69,5.58 v19.8,5.3 | R3.2 43.2,31.3 v42.4,32.1 | v42.5,22.7 v44.5,22.7
  Bottom 0.406: v19.8,5.3 19.8,6 20,6.2 20,18.3 20.6,18.9 24.8,18.9 25.8,17.9 28.5,17.9 31.1,20.5 31.1,22.6 31.5,23 31.5,23.4 33,24.9 34.1,24.9 34.8,24.2 34.8,22.3 35.3,21.8 40.4,21.8 41.1,21.1 43.4,21.1 44.5,22.2 v44.5,22.7 | v42.4,32.1 42.4,24.5 42.9,24 42.9,23.1 v42.5,22.7
VCC  (via drill 0.5)
  Top 0.406: R4.2 52.2,34.3 v51.3,35.2 | U2.6 29.63,25.78 31.2,24.2 31.7,24.2 32.4,24.9 | 32.4,24.9 32.3,25.41 U2.4 | R6.2 39.2,15.7 39,15.9 39,16.8 38.8,17 38.4,17 | 38.4,17 37.32,17 | 37.32,17 U2.18 34.7,19.6 33.7,20.6 33.7,21.7 34.6,22.6 34.6,24.2 33.9,24.9 32.4,24.9 | 37.32,17 37.32,17.52 C5.1 | v39.2,11.1 C4.1 | 38.4,17 v38.3,17.1 | U3.4 68.7,12.3 v68.9,12.1 | C9.1 v70.4,15.5 71.5,15.5 71.6,15.6 71.6,16.75 R9.2 R10.2 | IC3.4 v61.3,10.59 v61.3,10.6 | C1.1 55.87,14.74 v56.2,14.4
  Top 0.61: JP1.2 JP1.1 6.48,19.3 R1.E 11.94,17.53 12.2,17.27 12.2,15.49 11.94,15.24 11.94,13.72 12.7,12.95 13.47,12.95 14.62,11.8 X6.1 16.49,11.66 17.15,12.32 U$4.16 17.15,14.74 17.9,15.5 26.2,15.5 v27.7,17
  Bottom 0.406: v51.3,35.2 11.3,35.2 10.6,34.5 10.6,33.61 U1.2 | 39.5,14.5 44.94,14.5 J4.2 47.09,11.31 47.5,10.9 53.1,10.9 53.8,11.6 53.8,12.4 54.2,12.8 54.2,14.4 54.8,15 56.5,15 | 39.5,14.5 38.3,15.7 v38.3,17.1 | v39.2,11.1 39.2,14.2 39.5,14.5 | 56.5,15 60.6,15 61.4,14.2 61.4,10.7 v61.3,10.6 68.5,10.6 68.9,11 v68.9,12.1 70.3,12.1 70.4,12.2 v70.4,15.5 | v56.2,14.4 56.2,14.7 56.5,15
  Bottom 0.61: v27.7,17 30.6,17 31.9,15.7 34.9,15.7 36.3,17.1 v38.3,17.1
  pour Top (isolate 0.305, rank 6): 0.05,84.25 99.9,84.1 99.95,36.15 95,0 94.8,-0.1 0.3,0 0,0.3 -0.4,36.2
VIN+
  Top 0.406: U3.1 66.43,9.93 66,9.5 R11.2
  pour Top (isolate 0.305, no thermals): 63.6,10.4 63.6,-0.1 66.4,0.5 66.4,11.5 62.8,11.5
VIN-
  Top 0.406: U3.2 67.08,9.93 67.5,9.5 R11.1
  pour Top (isolate 0.305, no thermals): 67,11.5 67,0.5 70.4,0.5 70.4,11.5

### Text on the board
Dimension: MILL OUT FOR LCD | MILL OUT FOR LCD | MILL OUT FOR LCD | MILL OUT FOR LCD | MILL OUT FOR LCD | MILL OUT FOR LCD
bPlace: 5V | GND | CONTRAST | 5V | D- | MISO | SCK | RST | D+ | ISCP | GND | USB | 5V | MOSI | GND | N/C | SSR OUT | TEMP SENSE | I/V SENSE | GND | D8 | TK- | TK+ | VIN+ | VIN-
ophw_silk: D5 | D3 | D2 | D7 | D6 | D4 | 10K | 1K | 5V | A2 | 1K | 1K | GND | 22P | M328P | 5V | D9 | SCL | SDA | A3 | CONTRAST | 16Mhz | 10K | 10K | A1 | 4U7 | 10K | 22P | MISO | SCK | RST | 10K | 10K | MAX6675 | 104 | INA219 | 104 | 104 | 22P | 1K | 1K | CH340 | 5V | MOSI | GND | 10K | 104 | 104 | 12Mhz | 22P | LED | TK- | TK+ | VIN+ | VIN- | A0 | GND | D8 | 104